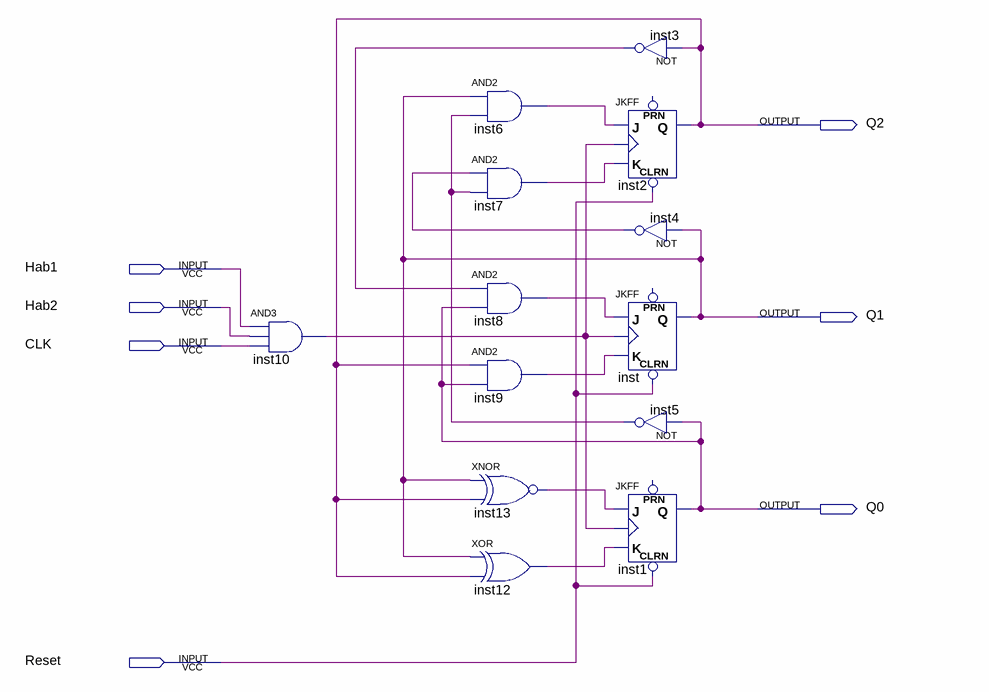
[diagram p0: schematic sheet]
// Quartus schematic Contador3bits.bdf as structural Verilog: 13 symbols, 7 pins
module Contador3bits (
  input  Hab1,
  input  Hab2,
  input  CLK,
  input  Reset,
  output Q2,
  output Q1,
  output Q0
);

  wire inst3_out, inst4_out, inst5_out, inst6_out, inst7_out, inst8_out, inst9_out, inst10_out, inst12_out,
       inst13_out;

  and inst10 (inst10_out, Hab1, Hab2, CLK);
  and inst6 (inst6_out, Q1, inst5_out);
  and inst7 (inst7_out, inst4_out, inst5_out);
  and inst8 (inst8_out, inst3_out, Q0);
  and inst9 (inst9_out, Q2, Q0);
  xnor inst13 (inst13_out, Q1, Q2);
  xor inst12 (inst12_out, Q1, Q2);
  not inst3 (inst3_out, Q2);
  JKFF inst2 (.CLRN(Reset), .K(inst7_out), .J(inst6_out), .CLK(inst10_out), .Q(Q2));  // open: PRN
  not inst4 (inst4_out, Q1);
  JKFF inst (.CLRN(Reset), .K(inst9_out), .J(inst8_out), .CLK(inst10_out), .Q(Q1));  // open: PRN
  not inst5 (inst5_out, Q0);
  JKFF inst1 (.CLRN(Reset), .K(inst12_out), .J(inst13_out), .CLK(inst10_out), .Q(Q0));  // open: PRN
endmodule
